# Altium schematic sheet Prototype.SchDoc: Наименование
size 420 x 297 mm; ApprovedBy: Сергеева А.А.; CheckedBy: Рогозин А.А.; Author: Кузнецов М.Д.; CompanyName: МГТУ им. Баумана; DocumentNumber: 5; SheetNumber: 1; SheetTotal: 1; PageSetup: Record=PageOptions|CenterHorizontal=True|CenterVertical=True|PrintScale=0.94|XCorrection=1.00|YCorrection=1.00|PrintKind=1|BorderSize=5000000|LeftOffset=0|BottomOffset=0|Orientation=1|PaperLength=1000|PaperWidth=1000|Scale=100|PaperSource=7|PrintQuality=-4|MediaType=1|DitherType=10|PaperKind=A4|PrintScaleMode=1; DecimalNumber: МГТУ.468784.001; HeadOfSector: Нач. сектора; MainDevice: Перв.примен.; Name1: Плата расширения; n_kontr: Н. Контр; t_kontr: Т. Контр; lit_A: О; Name2: для отладочного модуля; DocumentName: Sheet1.SCHDOC
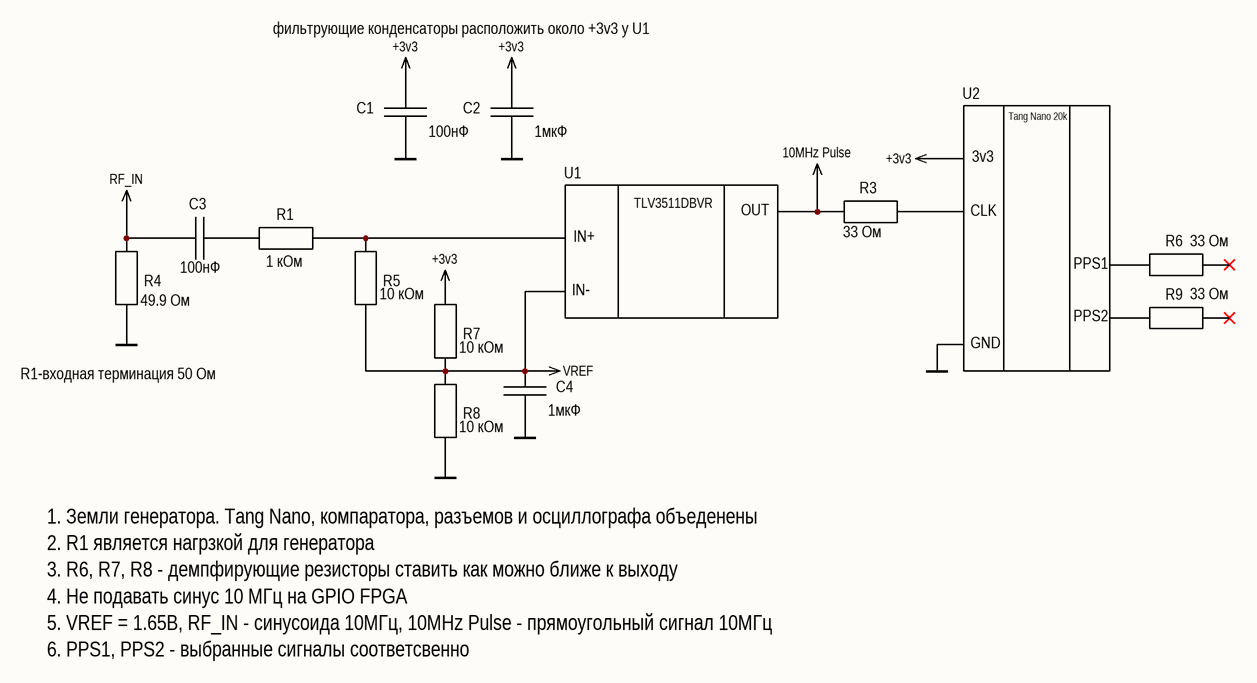
[diagram p0: Prototype.SchDoc]

## Parts
C1  100нФ  [C_0805]
C2  1мкФ  [C_0805]
C3  100нФ  [C_0805]
C4  1мкФ  [C_0805]
R1  1 кОм  [R_0805]
R3  33 Ом  [R_0603]
R4  49.9 Ом  [R_0603]
R5  10 кОм  [R_0603]
R6  33 Ом  [R_0603]
R7  10 кОм  [R_0603]
R8  10 кОм  [R_0603]
R9  33 Ом  [R_0603]
U1  TLV3511DBVR  (value not drawn)
U2  Tang Nano 20K  (value not drawn)

## Nets
10MHz Pulse: R3.2 U1.4
+3v3: C1.2 C2.2 R7.2 U2.2
GND: C1.1 C2.1 C4.1 R4.1 R8.1 U2.1
RF_IN: C3.1 R4.2
VREF: C4.2 R5.1 R7.1 R8.2 U1.1
NetC3_2: C3.2 R1.1
NetR1_2: R1.2 R5.2 U1.2
NetR3_1: R3.1 U2.3
NetR6_2: R6.2 U2.4
NetR9_2: R9.2 U2.5

Not connected (* = marked no-connect by the designer): R6 1*; R9 1*

## Notes on the sheet
- фильтрующие конденсаторы расположить около +3v3 у U1
- R1-входная терминация 50 Ом
- 1. Земли генератора. Tang Nano, компаратора, разъемов и осциллографа объеденены
- 2. R1 является нагрзкой для генератора
- 3. R6, R7, R8 - демпфирующие резисторы ставить как можно ближе к выходу
- 4. Не подавать синус 10 МГц на GPIO FPGA
- 5. VREF = 1.65В, RF_IN - синусоида 10МГц, 10MHz Pulse - прямоугольный сигнал 10МГц
- 6. PPS1, PPS2 - выбранные сигналы соответсвенно
- Перв.примен.
- Справ.№
- Подп. и дата
- Инв.№ дубл.
- Взам.инв.№
- Подп.и дата
- Разраб.
- Изм.
- Лист
- № докум.
- Подп.
- Дата
- Лит.
- Масштаб
- Масса
- Т.контр.
- Пров.
- СХЕМА   ЭЛЕКТРИЧЕСКАЯ
- ПРИНЦИПИАЛЬНАЯ
- Листов
- Инв.№ подл.
- Утв.
- Н.контр.
- Нач.сект.
- Формат  A3
- (in symbol Tang Nano 20K) Tang Nano 20k; 3v3; CLK; PPS1; PPS2; GND
- (in symbol TLV3511DBVR) OUT; IN+; IN-

## Library data of the parts
C1-C4 = Конденсатор GRM2165C1H331J (330 пФ +-5% COG 50В): Capacitance: 330p; Tolerance: ±5%; Dielectric Type: C0G; Maximum Voltage: 50V; Part Number: Конденсатор GRM2165C1H331J (330 пФ +-5% COG 50В); HelpURL: http://search.murata.co.jp/Ceramy/image/img/A01X/G101/ENG/GRM2165C1H331JA01-01.pdf
R1 = Резистор RC0805FR-071KL (1 кОм +-1%): Resistance: 1k; Tolerance: ±1%; Power: 0.125 W; Maximum Working Voltage: 150V; Maximum Overload Voltage: 300V; Part Number: Резистор RC0805FR-071KL (1 кОм +-1%); HelpURL: http://www.yageo.ru/pdf/RC0805.pdf
R3-R9 = Резистор RC0603JR-071KL (1 кОм +-5%): 47Ohm; Resistance: 1k; Tolerance: ±5%; Power: 0.1 W; Maximum Working Voltage: 50V; Maximum Overload Voltage: 100V; Part Number: Резистор RC0603JR-071KL (1 кОм +-5%); HelpURL: http://www.yageo.ru/pdf/RC0603.pdf